# Altium schematic sheet internet access.SchDoc
size A4
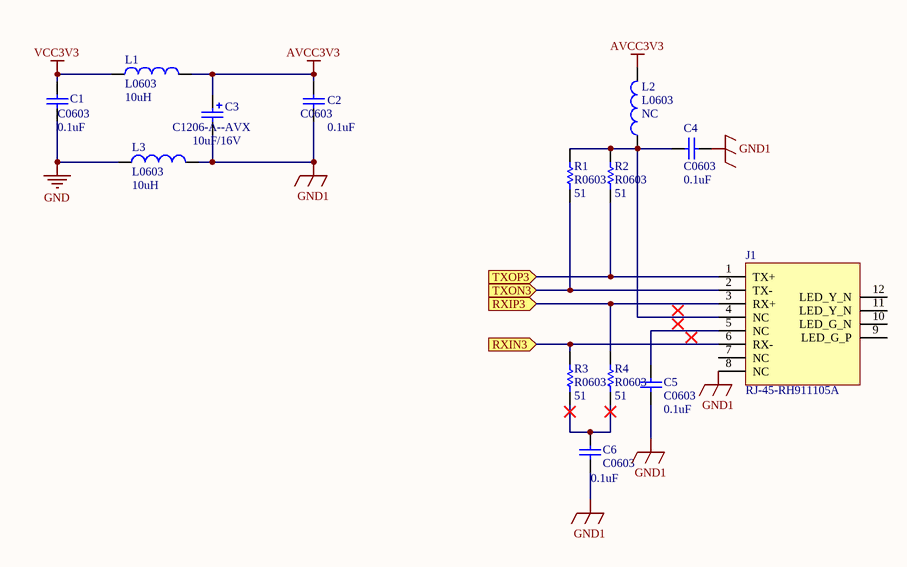
[diagram p0: internet access.SchDoc]

## Parts
C1  C0603  value 0.1uF  [C0603N]
C2  C0603  value 0.1uF  [C0603N]
C3  C1206-A--AVX  value 10uF/16V  [C1206-A]
C4  C0603  value 0.1uF  [C0603N]
C5  C0603  value 0.1uF  [C0603N]
C6  C0603  value 0.1uF  [C0603N]
J1  RJ-45-RH911105A  [RJ-45-HR911105A]
L1  L0603  value 10uH  [C0603N]
L2  L0603  value NC  [C0603N]
L3  L0603  value 10uH  [C0603N]
R1  R0603  value 51  [R0603N]
R2  R0603  value 51  [R0603N]
R3  R0603  value 51  [R0603N]
R4  R0603  value 51  [R0603N]

## Ports
RXIN3 (in), RXIP3 (in), TXON3 (in), TXOP3 (in)

## Nets
AVCC3V3: C2.1 C3.1 L1.2 L2.2
GND: C1.2 L3.1
GND1: C2.2 C3.2 C4.2 C5.1 C6.1 J1.8(NC) L3.2
VCC3V3: C1.1 L1.1
RXIN3: J1.6(RX-) R3.2 ; port RXIN3
RXIP3: J1.3(RX+) R4.2 ; port RXIP3
TXON3: J1.2(TX-) R1.1 ; port TXON3
TXOP3: J1.1(TX+) R2.1 ; port TXOP3
NetC4_1: C4.1 J1.4(NC) L2.1 R1.2 R2.2
NetC5_2: C5.2 J1.5(NC)
NetC6_2: C6.2 R3.1 R4.1

Not connected (* = marked no-connect by the designer): J1 7(NC) 9(LED_G_P) 10(LED_G_N) 11(LED_Y_N) 12(LED_Y_N)

## Library data of the parts
C1 C2 C4-C6 = Cap Semi: Capacitor (Semiconductor SIM Model)
C3 = Cap Pol3: Polarized Capacitor (Surface Mount)
L1-L3 = Inductor
R1-R4 = Res Semi: Semiconductor Resistor